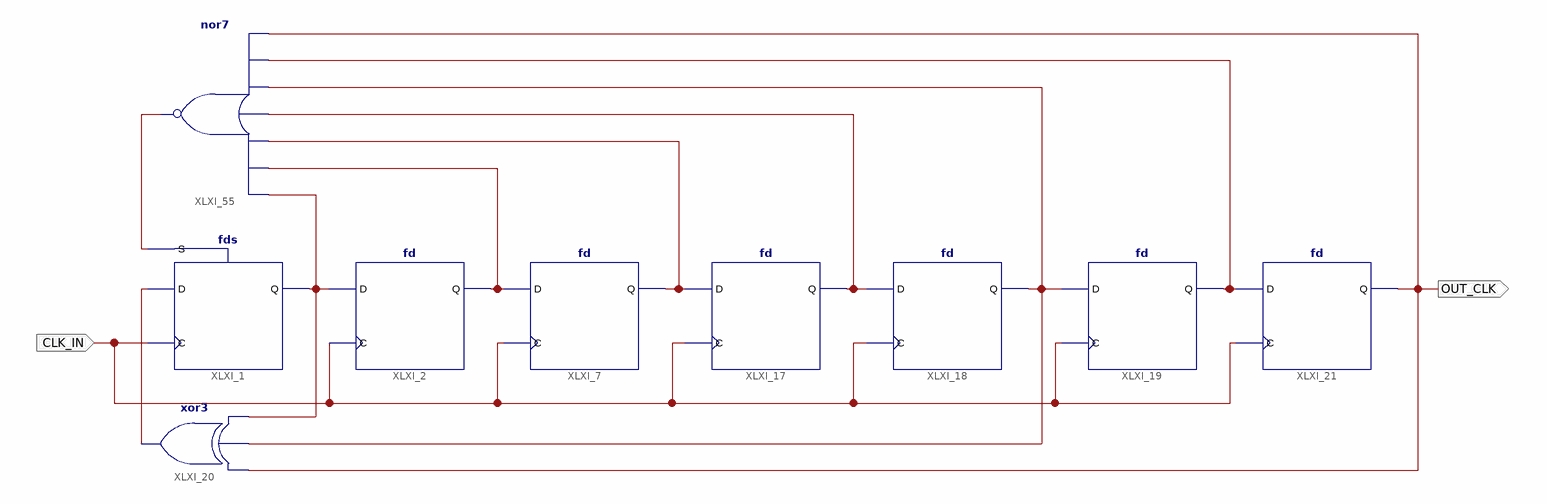
[diagram p0: schematic sheet 1]
// Xilinx ISE schematic LFSR7Bit.sch (spartan6) as structural Verilog: 9 symbols, 2 ports
module LFSR7Bit (
  input  CLK_IN,
  output OUT_CLK
);

  wire CLK_OUT, XLXN_1, XLXN_3, XLXN_13, XLXN_24, XLXN_25, XLXN_52, XLXN_109;

  fds XLXI_1 (.C(CLK_IN), .D(XLXN_1), .S(XLXN_109), .Q(XLXN_3));
  fd XLXI_2 (.C(CLK_IN), .D(XLXN_3), .Q(XLXN_13));
  xor XLXI_20 (XLXN_1, XLXN_3, XLXN_25, OUT_CLK);
  fd XLXI_19 (.C(CLK_IN), .D(XLXN_25), .Q(XLXN_52));
  fd XLXI_18 (.C(CLK_IN), .D(XLXN_24), .Q(XLXN_25));
  fd XLXI_17 (.C(CLK_IN), .D(CLK_OUT), .Q(XLXN_24));
  fd XLXI_21 (.C(CLK_IN), .D(XLXN_52), .Q(OUT_CLK));
  fd XLXI_7 (.C(CLK_IN), .D(XLXN_13), .Q(CLK_OUT));
  nor XLXI_55 (XLXN_109, OUT_CLK, XLXN_52, XLXN_25, XLXN_24, CLK_OUT, XLXN_13, XLXN_3);
endmodule
